# EAGLE design dimmer (EAGLE 6.5.0)
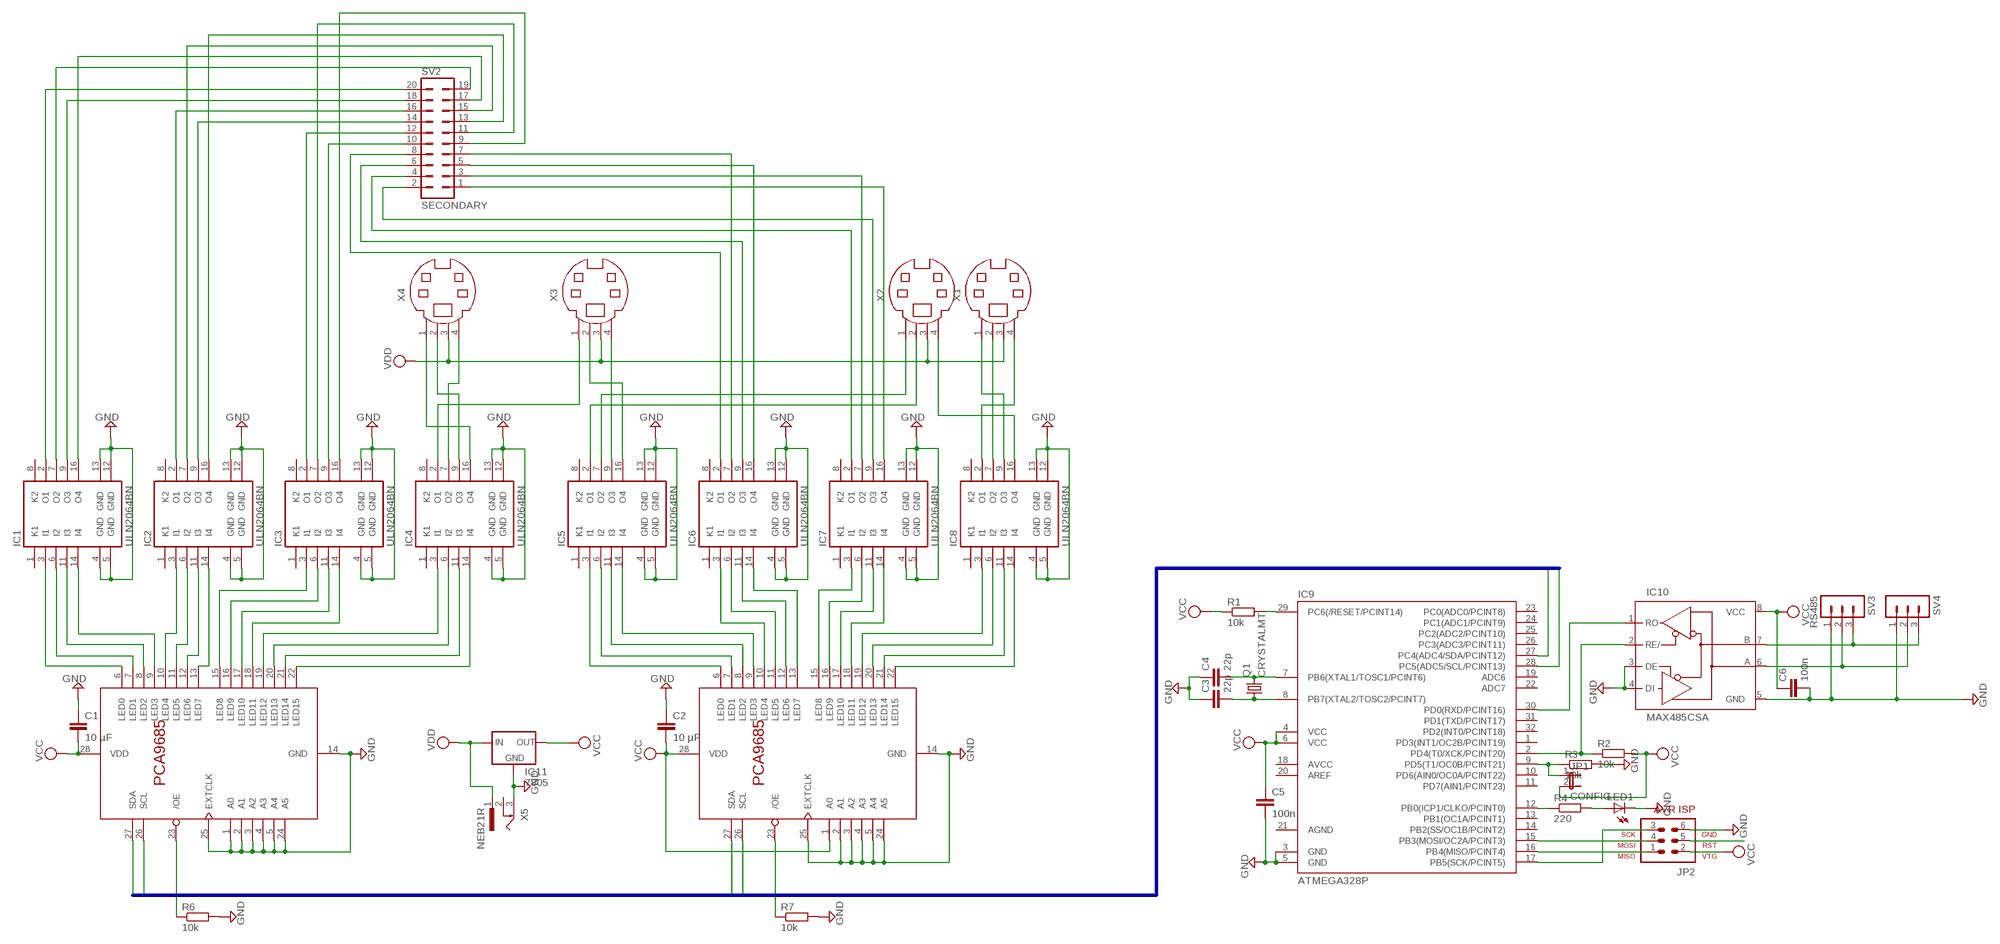
[diagram p0: schematic, sheet 1]

## Parts
C1  10 µF  C-EUC0805  [C0805]
C2  10 µF  C-EUC0805  [C0805]
C3  22p  C-EUC0805  [C0805]
C4  22p  C-EUC0805  [C0805]
C5  100n  C-EUC0805  [C0805]
C6  100n  C-EUC0805  [C0805]
IC1  ULN2064BN  [DIL16]
IC2  ULN2064BN  [DIL16]
IC3  ULN2064BN  [DIL16]
IC4  ULN2064BN  [DIL16]
IC5  ULN2064BN  [DIL16]
IC6  ULN2064BN  [DIL16]
IC7  ULN2064BN  [DIL16]
IC8  ULN2064BN  [DIL16]
IC9  ATMEGA328P  MEGA48/88/168-AU  [TQFP32-08]
IC10  MAX485CSA  MAX3468CSA  [SO08]
IC11  7805  78XXS  [78XXS]
JP1  CONFIG  JP1E  [JP1]
JP2  AVR-ISP-6  [AVR-ISP-6]
LED1  LEDCHIP-LED0603  [CHIP-LED0603]
Q1  CRYSTALMT  [MT]
R1  10k  R-EU_R0805  [R0805]
R2  10k  R-EU_R0805  [R0805]
R3  10k  R-EU_R0805  [R0805]
R4  220  R-EU_R0805  [R0805]
R6  10k  R-EU_R0805  [R0805]
R7  10k  R-EU_R0805  [R0805]
SV2  SECONDARY  MA10-2  [MA10-2]
SV3  RS485  MA03-1  [MA03-1]
SV4  MA03-1  [MA03-1]
U$1  PCA9685PW  [TSSOP28]
U$2  PCA9685PW  [TSSOP28]
X1  MD04S  [MDIN04S]
X2  MD04S  [MDIN04S]
X3  MD04S  [MDIN04S]
X4  MD04S  [MDIN04S]
X5  NEB21R  [NEB21R]

## Nets
GND: C1.1 C2.1 C3.1 C4.1 C5.2 C6.2 IC1.4(GND) IC1.5(GND) IC1.12(GND) IC1.13(GND) IC2.4(GND) IC2.5(GND) IC2.12(GND) IC2.13(GND) IC3.4(GND) IC3.5(GND) IC3.12(GND) IC3.13(GND) IC4.4(GND) IC4.5(GND) IC4.12(GND) IC4.13(GND) IC5.4(GND) IC5.5(GND) IC5.12(GND) IC5.13(GND) IC6.4(GND) IC6.5(GND) IC6.12(GND) IC6.13(GND) IC7.4(GND) IC7.5(GND) IC7.12(GND) IC7.13(GND) IC8.4(GND) IC8.5(GND) IC8.12(GND) IC8.13(GND) IC9.3(GND) IC9.5(GND) IC10.3(DE) IC10.4(DI) IC10.5(GND) IC11.GND JP2.6 LED1.C R3.2 R6.2 R7.2 SV3.1 SV4.1 U$1.1(A0) U$1.2(A1) U$1.3(A2) U$1.4(A3) U$1.5(A4) U$1.14(GND) U$1.24(A5) U$1.25(EXTCLK) U$2.2(A1) U$2.3(A2) U$2.4(A3) U$2.5(A4) U$2.14(GND) U$2.24(A5) U$2.25(EXTCLK) X5.3
N$1: IC1.3(I1) U$1.6(LED0)
N$2: IC1.6(I2) U$1.7(LED1)
N$3: IC1.11(I3) U$1.8(LED2)
N$4: IC1.14(I4) U$1.9(LED3)
N$5: IC4.14(I4) U$1.22(LED15)
N$6: IC4.11(I3) U$1.21(LED14)
N$7: IC4.6(I2) U$1.20(LED13)
N$8: IC4.3(I1) U$1.19(LED12)
N$9: IC3.14(I4) U$1.18(LED11)
N$10: IC3.11(I3) U$1.17(LED10)
N$11: IC3.6(I2) U$1.16(LED9)
N$12: IC3.3(I1) U$1.15(LED8)
N$13: IC2.14(I4) U$1.13(LED7)
N$14: IC2.11(I3) U$1.12(LED6)
N$15: IC2.6(I2) U$1.11(LED5)
N$16: IC2.3(I1) U$1.10(LED4)
N$17: IC7.14(I4) U$2.18(LED11)
N$18: IC5.6(I2) U$2.7(LED1)
N$19: IC5.11(I3) U$2.8(LED2)
N$20: IC5.14(I4) U$2.9(LED3)
N$21: IC5.3(I1) U$2.6(LED0)
N$22: IC6.3(I1) U$2.10(LED4)
N$23: IC6.6(I2) U$2.11(LED5)
N$24: IC6.11(I3) U$2.12(LED6)
N$25: IC6.14(I4) U$2.13(LED7)
N$26: IC8.14(I4) U$2.22(LED15)
N$27: IC8.11(I3) U$2.21(LED14)
N$28: IC8.6(I2) U$2.20(LED13)
N$29: IC8.3(I1) U$2.19(LED12)
N$30: IC7.11(I3) U$2.17(LED10)
N$31: IC7.6(I2) U$2.16(LED9)
N$32: IC7.3(I1) U$2.15(LED8)
N$33: IC8.2(O1) X1.4
N$34: IC8.7(O2) X1.2
N$35: IC8.9(O3) X1.1
N$36: R6.1 U$1.23(/OE)
N$37: IC8.16(O4) X2.4
N$38: IC5.2(O1) X2.2
N$39: IC5.7(O2) X2.1
N$40: IC5.9(O3) X3.4
N$41: IC5.16(O4) X3.2
N$42: IC4.2(O1) X3.1
N$43: IC4.7(O2) X4.4
N$44: IC4.9(O3) X4.2
N$45: IC4.16(O4) X4.1
N$46: IC1.2(O1) SV2.20
N$47: IC1.7(O2) SV2.19
N$48: IC1.9(O3) SV2.18
N$49: IC1.16(O4) SV2.17
N$50: IC2.2(O1) SV2.16
N$51: IC2.7(O2) SV2.15
N$52: IC2.9(O3) SV2.14
N$53: IC2.16(O4) SV2.13
N$54: IC3.2(O1) SV2.12
N$55: IC3.7(O2) SV2.11
N$56: IC3.9(O3) SV2.10
N$57: IC3.16(O4) SV2.9
N$58: IC6.2(O1) SV2.8
N$59: IC6.7(O2) SV2.7
N$60: IC6.9(O3) SV2.6
N$61: IC6.16(O4) SV2.5
N$62: IC7.2(O1) SV2.4
N$63: IC7.7(O2) SV2.3
N$64: IC7.9(O3) SV2.2
N$65: IC7.16(O4) SV2.1
N$66: R7.1 U$2.23(/OE)
N$67: C4.2 IC9.7(PB6(XTAL1/TOSC1/PCINT6)) Q1.P3
N$68: IC9.30(PD0(RXD/PCINT16)) IC10.1(RO)
N$69: C3.2 IC9.8(PB7(XTAL2/TOSC2/PCINT7)) Q1.P1
N$70: IC10.6(A) SV3.2 SV4.2
N$72: IC10.7(B) SV3.3 SV4.3
N$73: IC9.2(PD4(T0/XCK/PCINT20)) IC10.2(RE/) R2.1
N$74: IC9.9(PD5(T1/OC0B/PCINT21)) JP1.1 R3.1
N$75: IC9.12(PB0(ICP1/CLKO/PCINT0)) R4.1
N$76: LED1.A R4.2
N$77: IC9.17(PB5(SCK/PCINT5)) JP2.3
N$78: IC9.16(PB4(MISO/PCINT4)) JP2.1
N$79: IC9.15(PB3(MOSI/OC2A/PCINT3)) JP2.4
RESET: IC9.29(PC6(/RESET/PCINT14)) JP2.5 R1.2
SCL: IC9.28(PC5(ADC5/SCL/PCINT13)) U$1.26(SCL) U$2.26(SCL)
SDA: IC9.27(PC4(ADC4/SDA/PCINT12)) U$1.27(SDA) U$2.27(SDA)
VCC: C1.2 C2.2 C5.1 C6.1 IC9.4(VCC) IC9.6(VCC) IC10.8(VCC) IC11.OUT JP1.2 JP2.2 R1.1 R2.2 U$1.28(VDD) U$2.1(A0) U$2.28(VDD)
VDD: IC11.IN X1.3 X2.3 X3.3 X4.3 X5.1
Unconnected: IC1.1(K1) IC1.8(K2) IC2.1(K1) IC2.8(K2) IC3.1(K1) IC3.8(K2) IC4.1(K1) IC4.8(K2) IC5.1(K1) IC5.8(K2) IC6.1(K1) IC6.8(K2) IC7.1(K1) IC7.8(K2) IC8.1(K1) IC8.8(K2) IC9.1(PD3(INT1/OC2B/PCINT19)) IC9.10(PD6(AIN0/OC0A/PCINT22)) IC9.11(PD7(AIN1/PCINT23)) IC9.13(PB1(OC1A/PCINT1)) IC9.14(PB2(SS/OC1B/PCINT2)) IC9.18(AVCC) IC9.19(ADC6) IC9.20(AREF) IC9.22(ADC7) IC9.23(PC0(ADC0/PCINT8)) IC9.24(PC1(ADC1/PCINT9)) IC9.25(PC2(ADC2/PCINT10)) IC9.26(PC3(ADC3/PCINT11)) IC9.31(PD1(TXD/PCINT17)) IC9.32(PD2(INT0/PCINT18)) Q1.P2(GND) Q1.P4(GND1) X5.2

## Buses
SDA,SCL

## Power pins joined to a net without a drawn wire
AGND: IC9.21(AGND)

## Library data of the parts
C1-C6 = rcl:C-EU: CAPACITOR, European symbol
IC1-IC8 = uln-udn:ULN2064B: DRIVER ARRAY
IC9 = avr-6:MEGA48/88/168
IC10 = maxim:MAX34*: +5V, Fail-Safe, 40Mbps, Profibus RS-485/RS-422 Transceivers Source: MAX3465-MAX3469.pdf; MPN: MAX3468CSA+; OC_FARNELL: unknown; OC_NEWARK: 76K6721
IC11 = v-reg:78XXS: VOLTAGE REGULATOR
JP1 = jumper:JP1E: JUMPER
JP2 = avr-6:AVR-ISP-6: AVR ISP-6 Serial Programming Header
LED1 = led:LED: LED OSRAM: - CHIPLED LG R971, LG N971, LY N971, LG Q971, LY Q971, LO R971, LY R971 LH N974, LH R974 LS Q976, LO Q976, LY Q976 LO Q996 - Hyper CHIPLED LW Q18S LB Q993, LB Q99A, LB R99A - SideLED LS A670, LO A670, LY A670, LG A670, LP A670 LB A673, LV A673, LT A673, LW A673 LH A674 LY A675 LS A676, LA A676, LO A676, LY A676, LW A676 LS A679, LY A679, LG A679 - Hyper Micro SIDELED® LS Y876, LA Y876, LO Y876, LY Y876 LT Y87S - SmartLED LW L88C, LW L88S LB L89C, LB L89S, LG L890 LS L89K, LO L89K, LY L89K LS L896, LA L896, LO L896, LY L896 - TOPLED LS T670, LO T670, LY T670, LG T670, LP T670 LSG T670, LSP T670, LSY T670, LOP T670, LYG T670 LG T671, LOG T671, LSG T671 LB T673, LV T673, LT T673, LW T673 LH T674 LS T676, LA T676, LO T676, LY T676, LB T676, LH T676, LSB T676, LW T676 LB T67C, LV T67C, LT T67C, LS T67K, LO T67K, LY T67K, LW E67C LS E67B, LA E67B, LO E67B, LY E67B, LB E67C, LV E67C, LT E67C LW T67C LS T679, LY T679, LG T679 LS T770, LO T770, LY T770, LG T770, LP T770 LB T773, LV T773, LT T773, LW T773 LH T774 LS E675, LA E675, LY E675, LS T675 LS T776, LA T776, LO T776, LY T776, LB T776 LHGB T686 LT T68C, LB T68C - Hyper Mini TOPLED® LB M676 - Mini TOPLED Santana® LG M470 LS M47K, LO M47K, LY M47K Source: http://www.osram.convergy.de LUXEON: - LUMILED® LXK2-PW12-R00, LXK2-PW12-S00, LXK2-PW14-U00, LXK2-PW14-V00 LXK2-PM12-R00, LXK2-PM12-S00, LXK2-PM14-U00 LXK2-PE12-Q00, LXK2-PE12-R00, LXK2-PE12-S00, LXK2-PE14-T00, LXK2-PE14-U00 LXK2-PB12-K00, LXK2-PB12-L00, LXK2-PB12-M00, LXK2-PB14-N00, LXK2-PB14-P00, LXK2-PB14-Q00 LXK2-PR12-L00, LXK2-PR12-M00, LXK2-PR14-Q00, LXK2-PR14-R00 LXK2-PD12-Q00, LXK2-PD12-R00, LXK2-PD12-S00 LXK2-PH12-R00, LXK2-PH12-S00 LXK2-PL12-P00, LXK2-PL12-Q00, LXK2-PL12-R00 Source: www.luxeon.com KINGBRIGHT: KA-3528ASYC Source: www.kingbright.com
Q1 = Crystals-new:CRYSTAL
R1-R4 R6 R7 = rcl:R-EU_: RESISTOR, European symbol
SV2 = con-lstb:MA10-2: PIN HEADER; OC_FARNELL: unknown; OC_NEWARK: unknown
SV3 SV4 = con-lstb:MA03-1: PIN HEADER; OC_FARNELL: unknown; OC_NEWARK: unknown
U$1 U$2 = i2c-led-controller:PCA9685
X1-X4 = con-yamaichi:MD04S: YAMAICHI CONNECTOR; OC_FARNELL: unknown; OC_NEWARK: unknown
X5 = con-lumberg:NEB21R: Netzgeräte-Einbaukupplung abgewinkelte Ausführung mit Öffner Source: http://www.lumberg.com/Produkte/PDFs/NEB21R.pdf; MPN: NEB 21 R; OC_FARNELL: 1217037; OC_NEWARK: 97K6458

## Net classes
0 default: clearance 0.205 mm

## Board
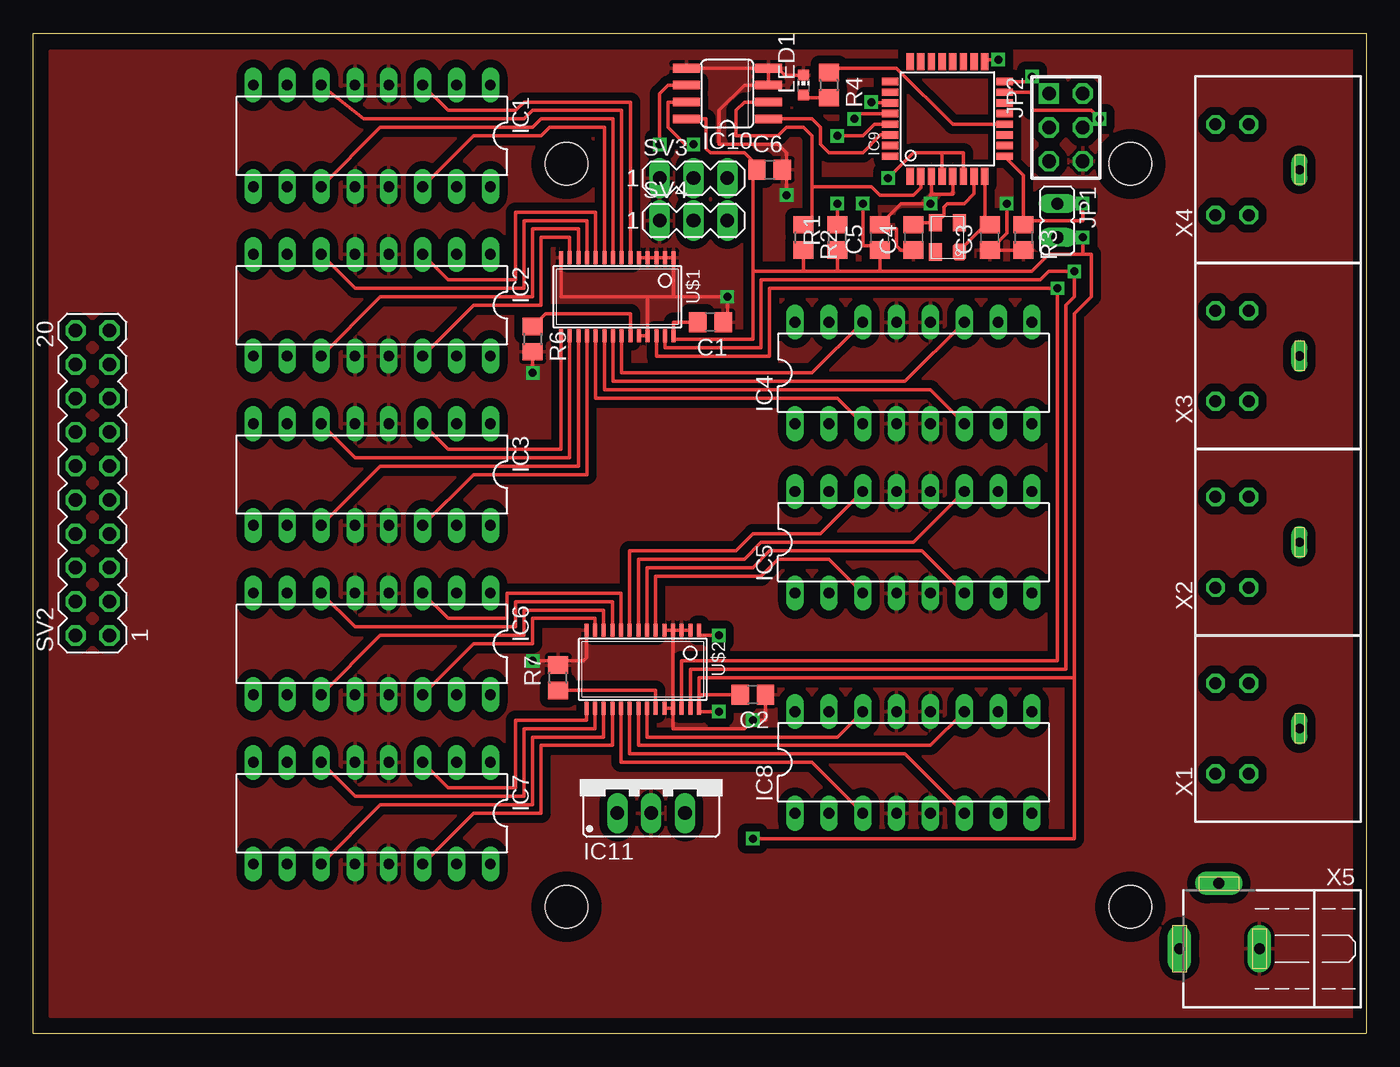
[diagram p1: board, top side]
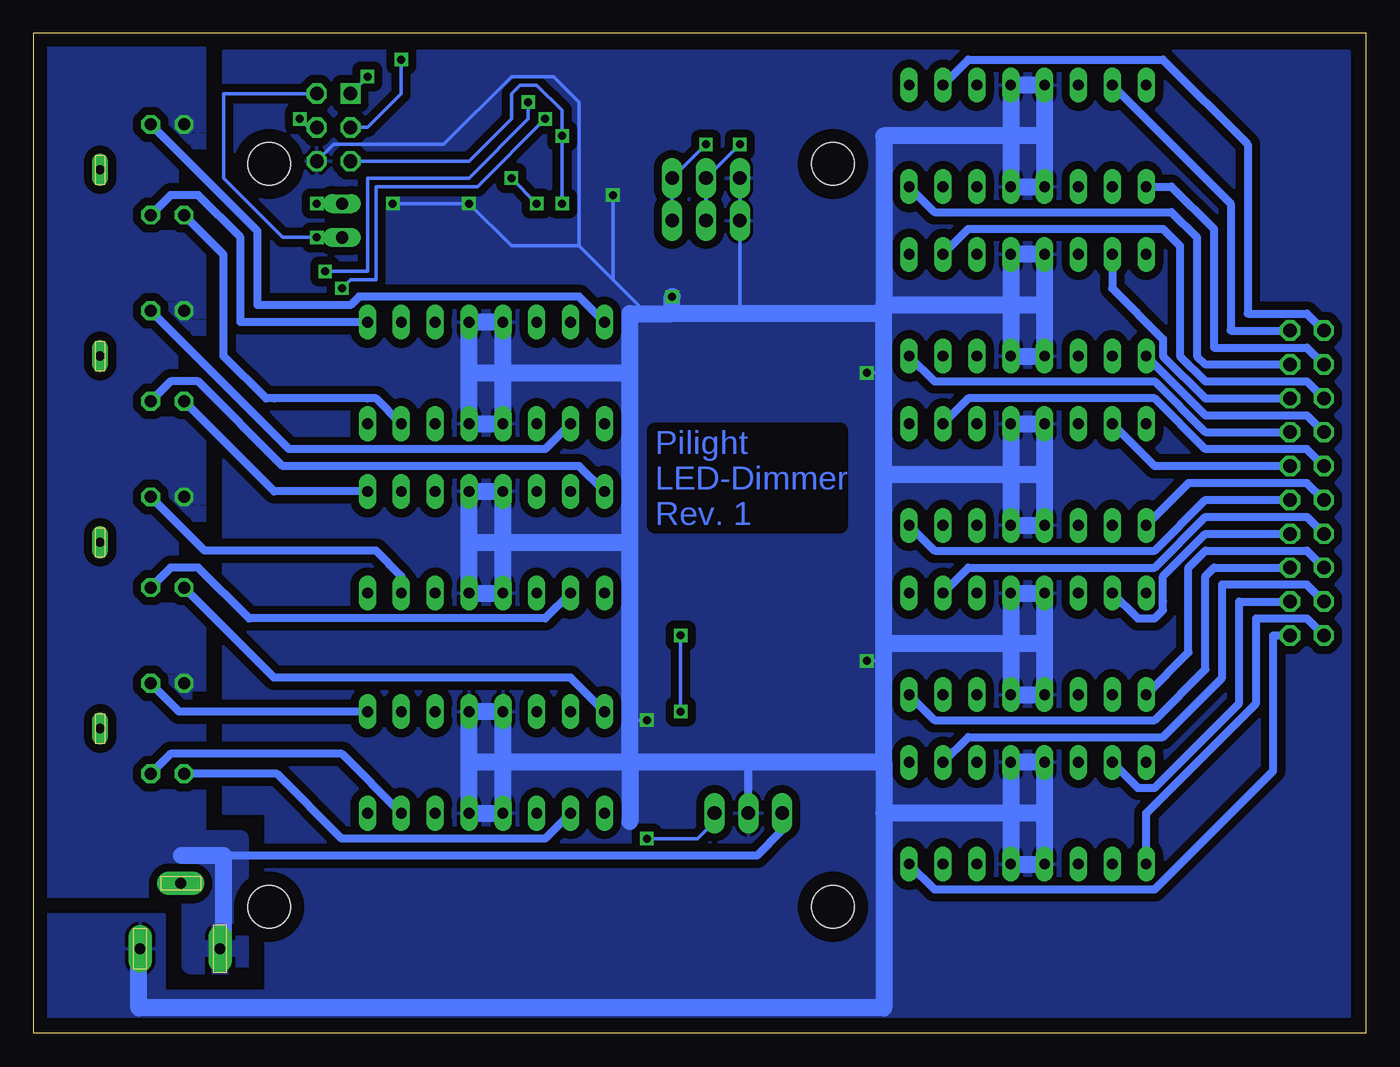
[diagram p2: board, bottom side, seen from below]

Size 100 x 75 mm. Coordinates in mm from the lower left corner, seen from the top.
Outline: 0,0 100,0 100,75 0,75 0,0
Copper layers (1*16): Top 0.035mm / dielectric 1.5mm / Bottom 0.035mm
Design rules "default *": minimum track width 10mil, minimum drill 10mil, track to track 8mil, track to pad 8mil, pad to pad 8mil, via to via 8mil, smd to smd 8mil, copper to edge 40mil, drill to drill 8mil, minimum pad ring 10mil, minimum via ring 8mil, stop-mask expansion 4mil, vias tented up to drill 0mil, thermal gap 10mil
Holes 3.2 mm at 40,9.5 82.3,9.5 82.3,65.2 40,65.2

### Footprints (pad centres in the part's own frame; a part is rotated, then mirrored left to right if it is on the bottom)
C0805 = smd 1.3 x 1.5: 1 -0.95,0; 2 0.95,0
DIL16 = drill 0.813 long: 1 -8.89,-3.81; 2 -6.35,-3.81; 3 -3.81,-3.81; 4 -1.27,-3.81; 5 1.27,-3.81; 6 3.81,-3.81; 7 6.35,-3.81; 8 8.89,-3.81; 9 8.89,3.81; 10 6.35,3.81; 11 3.81,3.81; 12 1.27,3.81; 13 -1.27,3.81; 14 -3.81,3.81; 15 -6.35,3.81; 16 -8.89,3.81
TQFP32-08 = smd 1.27 x 0.559: 1 -4.293,2.8; 2 -4.293,2; 3 -4.293,1.2; 4 -4.293,0.4; 5 -4.293,-0.4; 6 -4.293,-1.2; 7 -4.293,-2; 8 -4.293,-2.8; 17 4.293,-2.8; 18 4.293,-2; 19 4.293,-1.2; 20 4.293,-0.4; 21 4.293,0.4; 22 4.293,1.2; 23 4.293,2; 24 4.293,2.8 | smd 0.559 x 1.27: 9 -2.8,-4.293; 10 -2,-4.293; 11 -1.2,-4.293; 12 -0.4,-4.293; 13 0.4,-4.293; 14 1.2,-4.293; 15 2,-4.293; 16 2.8,-4.293; 25 2.8,4.293; 26 2,4.293; 27 1.2,4.293; 28 0.4,4.293; 29 -0.4,4.293; 30 -1.2,4.293; 31 -2,4.293; 32 -2.8,4.293
SO08 = smd 0.66 x 2.032: 1 -1.905,-3.073; 2 -0.635,-3.073; 3 0.635,-3.073; 4 1.905,-3.073; 5 1.905,3.073; 6 0.635,3.073; 7 -0.635,3.073; 8 -1.905,3.073
78XXS = drill 1.016 long: GND 0,-2.54; IN -2.54,-2.54; OUT 2.54,-2.54
JP1 = drill 0.914 long: 1 0,-1.27; 2 0,1.27
AVR-ISP-6 = drill 1.016 square: 1 -2.54,-1.27 | drill 1.016 octagon: 2 -2.54,1.27; 3 0,-1.27; 4 0,1.27; 5 2.54,-1.27; 6 2.54,1.27
CHIP-LED0603 = smd 0.8 x 0.8: A 0,-0.75; C 0,0.75
MT = smd 1.3 x 1: P1 -1.1,-0.9; P2 1.1,-0.9; P3 1.1,0.9; P4 -1.1,0.9
R0805 = smd 1.3 x 1.5: 1 -0.95,0; 2 0.95,0
MA10-2 = drill 1.016 octagon: 1 -11.43,-1.27; 2 -11.43,1.27; 3 -8.89,-1.27; 4 -8.89,1.27; 5 -6.35,-1.27; 6 -6.35,1.27; 7 -3.81,-1.27; 8 -3.81,1.27; 9 -1.27,-1.27; 10 -1.27,1.27; 11 1.27,-1.27; 12 1.27,1.27; 13 3.81,-1.27; 14 3.81,1.27; 15 6.35,-1.27; 16 6.35,1.27; 17 8.89,-1.27; 18 8.89,1.27; 19 11.43,-1.27; 20 11.43,1.27
MA03-1 = drill 1.016 long: 1 -2.54,0; 2 0,0; 3 2.54,0
TSSOP28 = smd 0.305 x 0.991: 1 -4.225,-2.918; 2 -3.575,-2.918; 3 -2.925,-2.918; 4 -2.275,-2.918; 5 -1.625,-2.918; 6 -0.975,-2.918; 7 -0.325,-2.918; 8 0.325,-2.918; 9 0.975,-2.918; 10 1.625,-2.918; 11 2.275,-2.918; 12 2.925,-2.918; 13 3.575,-2.918; 14 4.225,-2.918; 15 4.225,2.918; 16 3.575,2.918; 17 2.925,2.918; 18 2.275,2.918; 19 1.625,2.918; 20 0.975,2.918; 21 0.325,2.918; 22 -0.325,2.918; 23 -0.975,2.918; 24 -1.625,2.918; 25 -2.275,2.918; 26 -2.925,2.918; 27 -3.575,2.918; 28 -4.225,2.918
MDIN04S = drill 0.9 octagon: 1 3.4,8.5; 2 -3.4,8.5; 3 3.4,11; 4 -3.4,11 | drill 0.7 long: M 0,4.7
NEB21R = drill 0.813 pad 1.778 long: 1 0,7.35; 2 4.9,4.4; 3 0,1.35

### Placement (x,y rotation side)
C1  50.8,53.34 180 top
C2  53.98,25.4 180 top
C3  71.75,59.69 90 top
C4  66.04,59.69 90 top
C5  63.5,59.69 90 top
C6  55.24,64.77 0 top
IC1  25.4,67.31 180 top
IC2  25.4,54.61 180 top
IC3  25.4,41.91 180 top
IC4  66.04,49.53 0 top
IC5  66.04,36.83 0 top
IC6  25.4,29.21 180 top
IC7  25.4,16.51 180 top
IC8  66.04,20.32 0 top
IC9  68.58,68.58 90 top
IC10  52.07,70.48 90 top
IC11  46.35,19.05 0 top
JP1  76.83,60.96 180 top
JP2  77.47,67.94 270 top
LED1  57.78,71.12 0 top
Q1  68.58,59.69 90 top
R1  60.33,59.69 90 top
R2  57.78,59.69 270 top
R3  74.3,59.69 270 top
R4  59.69,71.12 270 top
R6  37.47,52.07 270 top
R7  39.37,26.67 90 top
SV2  4.45,41.27 90 top
SV3  49.53,64.14 0 top
SV4  49.53,60.96 0 top
U$1  43.81,55.24 180 top
U$2  45.72,27.3 180 top
X1  99.69,22.86 90 top
X2  99.69,36.83 90 top
X3  99.69,50.8 90 top
X4  99.69,64.77 90 top
X5  93.34,6.35 90 top

### Tracks (layer width: path | path; a pad name or v marks a point on that pad's centre or on a via)
GND  (via drill 0.6)
  Top 0.254: U$1.14 39.59,55.24 46.09,55.24 | U$2.25 47.99,22.86 53.34,22.86 v53.98,23.5 54.92,23.5 C2.1 | 48.04,55.24 v52.07,55.24 52.07,53.34 C1.1 | 48.04,55.24 46.09,55.24 | U$2.14 41.49,28.16 41.27,27.94 39.37,27.94 | 39.37,27.94 v37.47,27.94 | U$1.5 U$1.4 U$1.3 U$1.2 U$1.1 48.04,55.24 | U$2.5 U$2.4 | U$2.2 U$2.3 U$2.4 | IC10.4 IC10.3 | U$2.24 U$2.25 | U$2.25 U$2.4 | U$1.24 U$1.25 46.09,55.24 | IC10.5 IC10.4 | IC10.3 53.34,71.12 51.44,69.22 51.44,66.67 55.88,66.67 56.52,66.04 56.52,65.41 | R3.2 C3.1 73.03,60.01 v73.03,62.23 | 67.38,62.94 IC9.3 | IC9.5 68.98,62.94 67.38,62.94 | C4.1 65.08,58.74 64.77,59.05 64.77,60.33 63.81,60.33 C5.2 65.09,62.23 v67.31,62.23 67.31,62.87 67.38,62.94 | 39.37,27.94 R7.2 | R6.2 v37.47,49.53 | 55.26,71.23 IC10.3 | v56.52,62.87 56.52,64.77 C6.2 | LED1.C 56.4,71.87 55.88,72.39 IC10.4
  Bottom 0.254: v37.47,27.94 36.2,27.94 | v53.98,23.5 55.24,23.5 | 59.05,59.05 56.52,56.52 | 56.52,56.52 54.61,54.61 55.24,53.98 | SV3.1 SV4.1 46.99,53.98 | 59.05,59.05 64.14,59.05 v67.31,62.23 v73.03,62.23 | JP2.6 77.47,66.67 69.22,66.67 64.14,71.75 60.96,71.75 59.05,69.85 59.05,59.05 | v37.47,49.53 36.2,49.53 | v56.52,62.87 56.52,56.52
  Bottom 0.61: IC11.GND 46.35,20.32
  Bottom 1.27: IC5.5 IC5.4 IC5.13 IC5.12 67.31,36.83 | 24.13,54.61 IC2.5 IC2.4 IC2.13 IC2.12 24.13,54.61 | 24.13,41.91 IC3.5 IC3.4 IC3.13 IC3.12 24.13,41.91 | 24.13,67.31 IC1.5 IC1.4 IC1.13 IC1.12 24.13,67.31 | 24.13,29.21 IC6.5 IC6.4 IC6.13 IC6.12 24.13,29.21 | 24.13,16.51 IC7.12 IC7.13 IC7.4 IC7.5 24.13,16.51 | 67.31,20.32 IC8.5 IC8.4 IC8.13 IC8.12 67.31,20.32 | 67.31,33.66 67.31,36.83 | 67.31,49.53 IC4.5 IC4.4 IC4.13 IC4.12 67.31,49.53 | 36.2,20.32 46.35,20.32 55.24,20.32 | 55.24,20.32 67.31,20.32 | 36.2,20.32 36.2,27.94 36.2,29.21 | 36.2,29.21 36.2,41.91 | 36.2,41.91 36.2,49.53 36.2,53.98 | 36.2,53.98 36.2,54.61 | 55.24,20.32 55.24,15.88 | 55.24,20.32 55.24,23.5 55.24,36.83 | 55.24,36.83 55.24,49.53 | 55.24,49.53 55.24,53.98 52.07,53.98 | 67.31,36.83 55.24,36.83 | 67.31,49.53 55.24,49.53 | 24.13,67.31 36.2,67.31 36.2,54.61 | 24.13,54.61 36.2,54.61 | 24.13,41.91 36.2,41.91 | 24.13,29.21 36.2,29.21 | 36.2,20.32 36.2,16.51 | 36.2,16.51 36.2,1.91 92.08,1.91 92.08,6.35 | 24.13,16.51 36.2,16.51 | 36.2,53.98 46.99,53.98 52.07,53.98 | 52.07,53.98 v52.07,55.24
  pour Bottom (isolate 0.61): 90.17,3.17 90.17,8.89 99.69,8.89 99.69,1.27 1.27,1.27 1.27,73.66 85.72,73.66 85.72,16.51 82.55,16.51 82.55,3.17
  pour Top (isolate 0.61): 1.27,73.66 99.06,73.66 99.06,1.27 1.27,1.27
N$1
  Top 0.254: IC1.3 31.11,69.22 36.2,69.22 36.83,69.85 44.79,69.85 U$1.6
N$2
  Top 0.254: IC1.6 24.77,68.58 36.83,68.58 37.47,69.22 44.14,69.22 U$1.7
N$3
  Top 0.254: IC1.11 26.04,67.94 37.47,67.94 38.1,68.58 43.49,68.58 U$1.8
N$4
  Top 0.254: IC1.14 33.02,67.31 38.1,67.31 38.73,67.94 42.84,67.94 U$1.9
N$5
  Top 0.254: IC4.14 58.42,49.53 44.14,49.53 U$1.22
N$6
  Top 0.254: IC4.11 65.41,48.9 43.49,48.9 U$1.21
N$7
  Top 0.254: IC4.6 67.31,48.26 42.84,48.26 U$1.20
N$8
  Top 0.254: IC4.3 60.33,47.62 42.19,47.62 U$1.19
N$9
  Top 0.254: IC3.14 33.02,41.91 41.54,41.91 U$1.18
N$10
  Top 0.254: IC3.11 26.04,42.55 40.89,42.55 U$1.17
N$11
  Top 0.254: IC3.6 24.13,43.18 40.24,43.18 U$1.16
N$12
  Top 0.254: IC3.3 31.11,43.81 39.59,43.81 U$1.15
N$13
  Top 0.254: IC2.14 33.02,54.61 38.1,54.61 38.1,59.69 40.24,59.69 U$1.13
N$14
  Top 0.254: IC2.11 26.04,55.24 37.47,55.24 37.47,60.33 40.89,60.33 U$1.12
N$15
  Top 0.254: IC2.6 24.13,55.88 36.83,55.88 36.83,60.96 41.54,60.96 U$1.11
N$16
  Top 0.254: IC2.3 31.11,56.52 36.2,56.52 36.2,61.59 42.19,61.59 U$1.10
N$17
  Top 0.254: IC7.14 33.02,16.51 38.1,16.51 38.1,21.59 43.45,21.59 U$2.18
N$18
  Top 0.254: IC5.6 66.67,36.2 55.24,36.2 53.98,34.92 46.05,34.92 U$2.7
N$19
  Top 0.254: IC5.11 66.04,36.83 54.61,36.83 53.34,35.56 45.4,35.56 U$2.8
N$20
  Top 0.254: IC5.14 59.05,37.47 53.98,37.47 52.7,36.2 44.74,36.2 U$2.9
N$21
  Top 0.254: IC5.3 59.69,35.56 55.88,35.56 54.61,34.29 46.7,34.29 U$2.6
N$22
  Top 0.254: IC6.3 31.11,31.11 35.56,31.11 35.56,33.02 44.09,33.02 U$2.10
N$23
  Top 0.254: IC6.6 24.13,30.48 36.2,30.48 36.2,32.38 43.45,32.38 U$2.11
N$24
  Top 0.254: IC6.11 26.04,29.84 36.83,29.84 36.83,31.75 42.8,31.75 U$2.12
N$25
  Top 0.254: IC6.14 33.02,29.21 37.47,29.21 37.47,31.11 42.15,31.11 U$2.13
N$26
  Top 0.254: IC8.14 60.33,22.23 46.05,22.23 U$2.22
N$27
  Top 0.254: IC8.11 67.31,21.59 45.4,21.59 U$2.21
N$28
  Top 0.254: IC8.6 65.41,20.95 44.74,20.95 U$2.20
N$29
  Top 0.254: IC8.3 58.42,20.32 44.09,20.32 U$2.19
N$30
  Top 0.254: IC7.11 26.04,17.14 37.47,17.14 37.47,22.23 42.8,22.23 U$2.17
N$31
  Top 0.254: IC7.6 24.13,17.78 36.83,17.78 36.83,22.86 42.15,22.86 U$2.16
N$32
  Top 0.254: IC7.3 31.11,18.41 36.2,18.41 36.2,23.5 41.49,23.5 U$2.15
N$33
  Bottom 0.61: IC8.2 61.59,14.61 76.86,14.61 81.71,19.46 X1.4
N$34
  Bottom 0.61: IC8.7 76.83,20.95 89.7,20.95 X1.2
N$35
  Bottom 0.61: IC8.9 89.06,24.13 X1.1
N$36
  Top 0.254: U$1.23 44.79,53.98 38.42,53.98 R6.1
N$37
  Bottom 0.61: IC8.16 59.69,26.67 81.94,26.67 X2.4
N$38
  Bottom 0.61: IC5.2 61.59,31.11 83.82,31.11 87.63,34.92 89.7,34.92 X2.2
N$39
  Bottom 0.61: IC5.7 72.39,34.29 74.3,36.2 87.16,36.2 X2.1
N$40
  Bottom 0.61: IC5.9 81.94,40.64 X3.4
N$41
  Bottom 0.61: IC5.16 59.05,42.55 81.28,42.55 87.63,48.9 89.7,48.9 X3.2
N$42
  Bottom 0.61: IC4.2 61.59,43.81 80.81,43.81 X3.1
N$43
  Bottom 0.61: IC4.7 74.3,47.62 74.95,47.62 81.92,47.62 82.55,47.62 85.72,50.8 85.72,58.4 X4.4
N$44
  Bottom 0.61: IC4.9 84.45,53.34 84.45,59.69 87.63,62.87 89.7,62.87 X4.2
N$45
  Bottom 0.61: IC4.16 59.05,55.24 75.56,55.24 76.2,54.61 83.19,54.61 83.19,60.16 X4.1
N$46
  Bottom 0.61: IC1.2 29.84,73.03 15.24,73.03 8.89,66.67 8.89,53.98 4.45,53.98 SV2.20
N$47
  Bottom 0.61: IC1.7 10.16,62.23 10.16,52.7 SV2.19
N$48
  Bottom 0.61: IC1.9 14.61,63.5 11.43,60.33 11.43,51.44 4.45,51.44 SV2.18
N$49
  Bottom 0.61: IC1.16 32.38,61.59 14.61,61.59 12.7,59.69 12.7,50.8 12.06,50.16 SV2.17
N$50
  Bottom 0.61: IC2.2 29.84,60.33 15.24,60.33 13.97,59.05 13.97,50.8 12.06,48.9 4.45,48.9 SV2.16
N$51
  Bottom 0.61: IC2.7 19.05,55.88 15.24,52.07 15.24,50.8 12.06,47.62 SV2.15
N$52
  Bottom 0.61: IC2.9 12.06,46.35 4.45,46.35 SV2.14
N$53
  Bottom 0.61: IC2.16 32.38,48.9 15.88,48.9 12.06,45.09 SV2.13
N$54
  Bottom 0.61: SV2.12 4.45,43.81 12.06,43.81 15.88,47.62 29.84,47.62 IC3.2
N$55
  Bottom 0.61: SV2.11 15.88,42.55 IC3.7
N$56
  Bottom 0.61: SV2.10 4.45,41.27 13.34,41.27 IC3.9
N$57
  Bottom 0.61: IC3.16 32.38,36.2 15.88,36.2 12.06,40.01 SV2.9
N$58
  Bottom 0.61: IC6.2 29.84,34.92 15.88,34.92 12.06,38.73 4.45,38.73 SV2.8
N$59
  Bottom 0.61: IC6.7 17.14,31.11 15.88,31.11 15.24,31.75 15.24,32.38 15.24,34.29 12.06,37.47 SV2.7
N$60
  Bottom 0.61: IC6.9 13.34,28.57 13.34,34.92 12.06,36.2 4.45,36.2 SV2.6
N$61
  Bottom 0.61: IC6.16 32.38,23.5 15.88,23.5 12.06,27.3 12.06,34.29 11.43,34.92 SV2.5
N$62
  Bottom 0.61: IC7.2 29.84,22.23 15.24,22.23 10.79,26.67 10.79,33.66 4.45,33.66 SV2.4
N$63
  Bottom 0.61: IC7.7 17.14,18.41 15.88,18.41 9.53,24.77 9.53,32.38 SV2.3
N$64
  Bottom 0.61: IC7.9 16.51,16.51 8.26,24.77 8.26,31.11 4.45,31.11 SV2.2
N$65
  Bottom 0.61: IC7.16 32.38,10.79 15.88,10.79 6.99,19.68 6.99,29.84 SV2.1
N$66
  Top 0.254: R7.1 46.7,25.71 U$2.23
N$67
  Top 0.254: C4.2 66.19,60.79 Q1.P3 68.31,61.33 68.31,61.97 68.58,62.23 69.85,62.23 70.58,62.96 IC9.7
N$68
  Top 0.254: IC9.30 63.57,67.38 62.23,66.04 59.69,66.04 59.05,66.67 59.05,67.94 58.42,68.58 IC10.1
N$69
  Top 0.254: IC9.8 71.38,60.9 C3.2 71.12,60.33 69.48,58.69 Q1.P1
N$70  (via drill 0.6)
  Top 0.254: v46.99,66.67 46.99,70.48 47.62,71.12 IC10.6
  Bottom 0.254: SV4.2 SV3.2 v46.99,66.67
N$72  (via drill 0.6)
  Top 0.254: v49.53,66.67 48.9,66.67 47.62,67.94 47.62,69.85 IC10.7
  Bottom 0.254: SV4.3 SV3.3 v49.53,66.67
N$73
  Top 0.254: R2.1 57.78,60.33 58.42,60.96 58.42,63.5 | IC10.2 53.34,69.85 52.7,69.22 52.7,67.31 55.88,67.31 56.52,67.94 57.78,67.94 58.42,67.31 58.42,63.5 | IC9.2 66.58,63.41 66.04,62.87 63.5,62.87 62.87,63.5 58.42,63.5
N$74  (via drill 0.6)
  Top 0.254: v78.74,62.23 78.74,60.96 74.61,60.96 R3.1 74.3,64.36 IC9.9
  Bottom 0.254: v78.74,62.23 JP1.1
N$75
  Top 0.254: IC9.12 68.98,68.18 64.77,72.39 60.01,72.39 R4.1
N$76
  Top 0.254: R4.2 57.98,70.17 LED1.A
N$77  (via drill 0.6)
  Top 0.254: v72.39,73.03 71.53,73.03 IC9.17
  Bottom 0.254: JP2.3 74.93,67.94 72.39,70.48 v72.39,73.03
N$78  (via drill 0.6)
  Top 0.254: IC9.16 74.56,71.38 v74.93,71.75
  Bottom 0.254: v74.93,71.75 JP2.1
N$79  (via drill 0.6)
  Top 0.254: IC9.15 74.83,70.58 74.93,70.48 74.93,69.22 79.38,69.22 v80.01,68.58
  Bottom 0.254: v80.01,68.58 79.38,67.94 JP2.4
RESET  (via drill 0.6)
  Top 0.254: IC9.29 63.1,68.18 62.23,67.31 v60.33,67.31 | v60.33,62.23 R1.2
  Bottom 0.254: v60.33,62.23 v60.33,67.31 60.33,69.22 62.23,71.12 63.5,71.12 64.14,70.48 64.14,68.58 67.31,65.41 JP2.5
SCL  (via drill 0.6)
  Top 0.254: U$2.26 48.65,27.94 76.83,27.94 v76.83,55.88 55.24,55.88 55.24,50.8 46.74,50.8 U$1.26 | IC9.28 61.59,68.98 v61.59,68.58
  Bottom 0.254: v61.59,68.58 66.67,63.5 74.3,63.5 74.3,56.52 76.2,56.52 v76.83,55.88
SDA  (via drill 0.6)
  Top 0.254: U$2.27 49.3,27.3 77.47,27.3 77.47,54.61 78.11,55.24 v78.11,57.15 76.2,57.15 75.56,56.52 54.61,56.52 54.61,51.44 47.39,51.44 U$1.27 | IC9.27 62.87,69.78 v62.87,69.85
  Bottom 0.254: v62.87,69.85 62.87,68.58 67.31,64.14 68.58,64.14 74.93,64.14 74.93,57.15 v78.11,57.15
VCC  (via drill 0.6)
  Top 0.254: U$2.1 49.95,29.84 v51.44,29.84 | v51.44,24.13 49.95,24.13 U$2.28 49.95,25.4 | 78.11,26.67 49.95,26.67 49.95,25.4 | 78.74,58.42 79.38,58.42 79.38,55.24 78.11,53.98 78.11,26.67 | 78.74,58.42 76.2,58.42 74.93,57.15 63.5,57.15 | 63.5,57.15 60.33,57.15 | 60.33,57.15 57.78,57.15 | 57.78,57.15 53.98,57.15 | 53.98,57.15 53.98,52.07 48.04,52.07 U$1.28 48.04,53.34 C1.2 | C2.2 49.95,25.4 | 53.98,57.15 53.98,64.45 C6.1 | IC10.8 50.48,68.58 50.48,66.36 50.8,66.04 53.34,66.04 53.98,65.41 53.98,65.09 C6.1 | R1.1 60.33,57.15 | IC9.6 69.78,66.04 68.18,66.04 | IC9.4 68.18,66.04 | 68.18,66.04 66.04,66.04 v64.14,64.14 | 63.5,57.15 C5.1 63.19,59.05 62.23,59.05 v62.23,62.23 | v78.74,59.69 78.74,58.42 | 78.11,26.67 78.11,14.61 v53.98,14.61 | R2.2 57.78,57.15 | C6.1 53.98,64.77
  Bottom 0.254: v51.44,29.84 v51.44,24.13 | JP1.2 v78.74,59.69 81.28,59.69 85.72,64.14 85.72,70.48 JP2.2 | v62.23,62.23 v64.14,64.14 | v53.98,14.61 50.16,14.61 48.9,15.88 IC11.OUT
VDD
  Bottom 0.61: 85.72,13.34 45.72,13.34 43.81,15.24 IC11.IN
  Bottom 1.27: X5.1 85.72,6.35 85.72,13.34 88.9,13.34
  pour Bottom (isolate 0.61): 87.63,73.66 99.06,73.66 99.06,10.79 88.27,10.79 88.27,5.08 84.45,5.08 84.45,14.61 87.63,14.61

### Text on the board
Bottom: Pilight / LED-Dimmer / Rev. 1